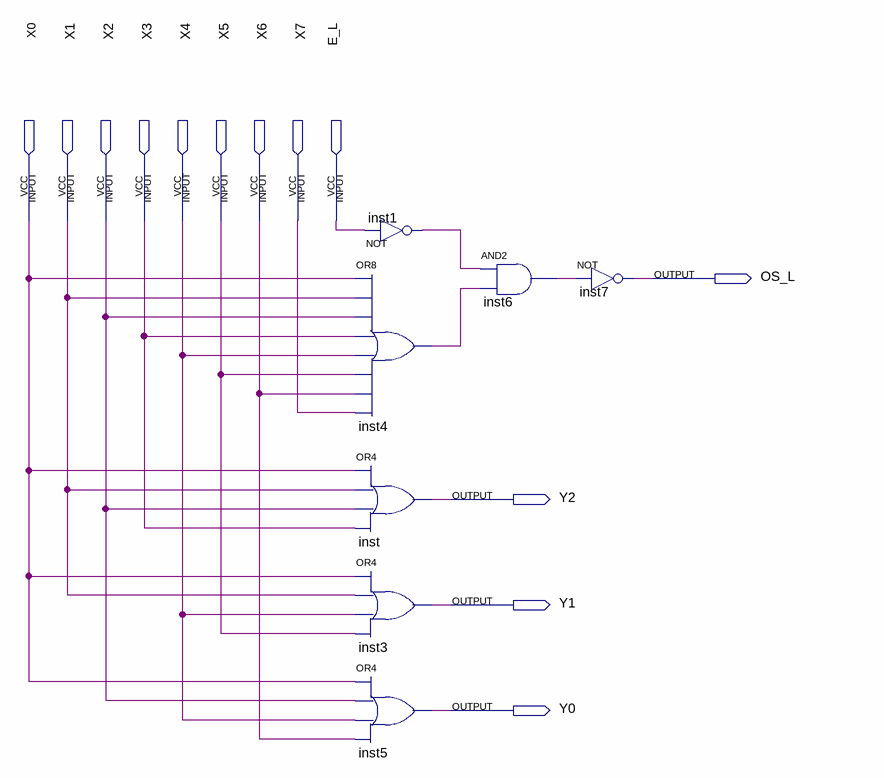
[diagram p0: schematic sheet]
// Quartus schematic PEnc8_3.bdf as structural Verilog: 7 symbols, 13 pins
module PEnc8_3 (
  input  X0,
  input  X1,
  input  X2,
  input  X3,
  input  X4,
  input  X5,
  input  X6,
  input  X7,
  input  E_L,
  output OS_L,
  output Y2,
  output Y1,
  output Y0
);

  wire inst1_out, inst4_out, inst6_out;

  not inst1 (inst1_out, E_L);
  or inst4 (inst4_out, X0, X1, X2, X3, X4, X5, X6, X7);
  or inst (Y2, X0, X1, X2, X3);
  or inst3 (Y1, X0, X1, X4, X5);
  or inst5 (Y0, X0, X2, X4, X6);
  and inst6 (inst6_out, inst1_out, inst4_out);
  not inst7 (OS_L, inst6_out);
endmodule
